# Altium schematic sheet Disp.SchDoc
size 297 x 209 mm; SheetNumber: 2; SheetTotal: 4
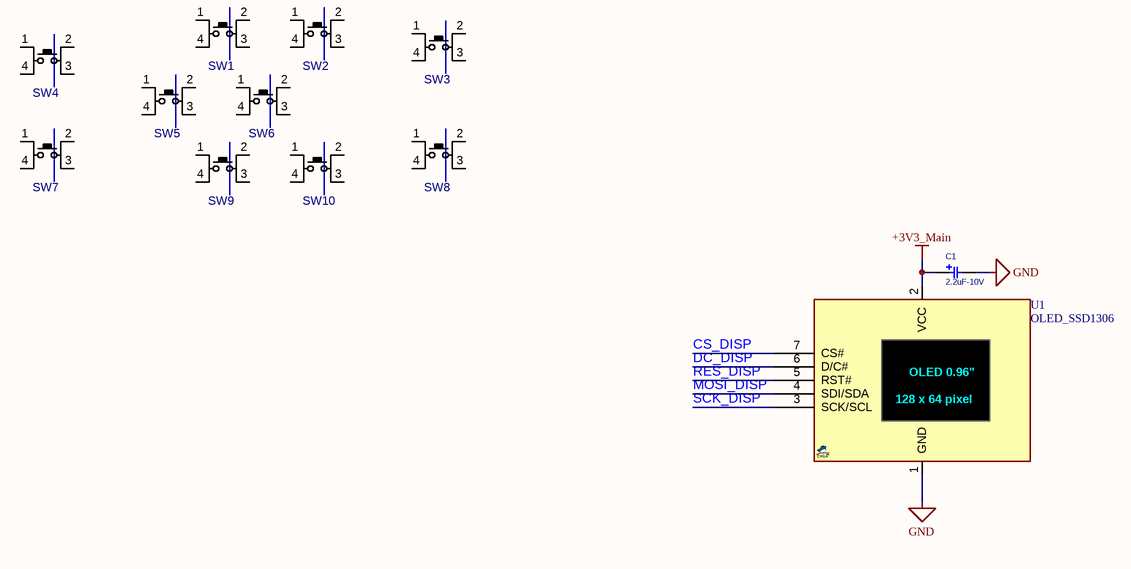
[diagram p0: Disp.SchDoc]

## Parts
C1  2.2uF-10V  [C_TN_3216]
SW1  PUSHBUTTON  [SWPBS_SPDT_6X6X4]  (value not drawn)
SW2  PUSHBUTTON  [SWPBS_SPDT_6X6X4]  (value not drawn)
SW3  PUSHBUTTON  [SWPBS_SPDT_6X6X4]  (value not drawn)
SW4  PUSHBUTTON  [SWPBS_SPDT_3X3TS]  (value not drawn)
SW5  PUSHBUTTON  [SWPBS_SPDT_6X6X4]  (value not drawn)
SW6  PUSHBUTTON  [SWPBS_SPDT_6X6X4]  (value not drawn)
SW7  PUSHBUTTON  [SWPBS_SPDT_3X3TS]  (value not drawn)
SW8  PUSHBUTTON  [SWPBS_SPDT_6X6X4]  (value not drawn)
SW9  PUSHBUTTON  [SWPBS_SPDT_6X6X4]  (value not drawn)
SW10  PUSHBUTTON  [SWPBS_SPDT_6X6X4]  (value not drawn)
U1  OLED_SSD1306  [OLED_SSD1306_64_SPI]

## Nets
+3V3_Main: C1.1 U1.2(VCC)
GND: C1.2 U1.1(GND)
CS_DISP: U1.7(CS#)
DC_DISP: U1.6(D/C#)
MOSI_DISP: U1.4(SDI/SDA)
RES_DISP: U1.5(RST#)
SCK_DISP: U1.3(SCK/SCL)

Not connected (* = marked no-connect by the designer): SW1 1(P1) 2(P3) 3(P4) 4(P2); SW2 1(P1) 2(P3) 3(P4) 4(P2); SW3 1(P1) 2(P3) 3(P4) 4(P2); SW4 1(P1) 2(P3) 3(P4) 4(P2); SW5 1(P1) 2(P3) 3(P4) 4(P2); SW6 1(P1) 2(P3) 3(P4) 4(P2); SW7 1(P1) 2(P3) 3(P4) 4(P2); SW8 1(P1) 2(P3) 3(P4) 4(P2); SW9 1(P1) 2(P3) 3(P4) 4(P2); SW10 1(P1) 2(P3) 3(P4) 4(P2)

## Notes on the sheet
- Drawn
- Name
- Date
- Drawing Title
- Checked
- Drawing No.
- Approved
- Size
- A4
- Ver.
- Rev.
- Sheet
- Of
- (in symbol OLED_SSD1306_64_SPI) OLED 0.96"; 128 x 64 pixel

## Library data of the parts
C1 = CAP_SMD_TAN: CAP, SMD, TAN,; PARAM2: -V; VALUE: 2.2uF-10V
SW1-SW3 SW5 SW6 SW8-SW10 = SWPBS_SPDT_6X6X4: SWITCH, PUSH BUTTON, TACTILE, SMD, SPDT, 6X6X4.3mm; MANF: Bond-Tact; DESC: DESCRIPTION; MANF_P#: TS-1143S; VALUE: PUSHBUTTON; ASSEMBLY: ASSEMBLY; PARAM: PARAM; PRICE: PRICE
SW4 SW7 = SWPBS_SPDT_3X3TS: SWITCH, PUSH BUTTON, TACTILE, SMD, SPDT, 3X3MM; MANF: CHINA; DESC: DESCRIPTION; MANF_P#: TS-1233; VALUE: PUSHBUTTON; ASSEMBLY: ASSEMBLY; PARAM: PARAM; PRICE: 1000= 5$
U1 = OLED_SSD1306_64_SPI: OLED, SSD1306, 0.96", 128X64, BREAKOUT SPI; MANF_P#: OLED_SSD1306_I2C; PARAM2: 3.3/5VCC, -20~70oC; PARAM: 2 Colors, 0.96", 128X64; MANF: -; VALUE: OLED_SSD1306